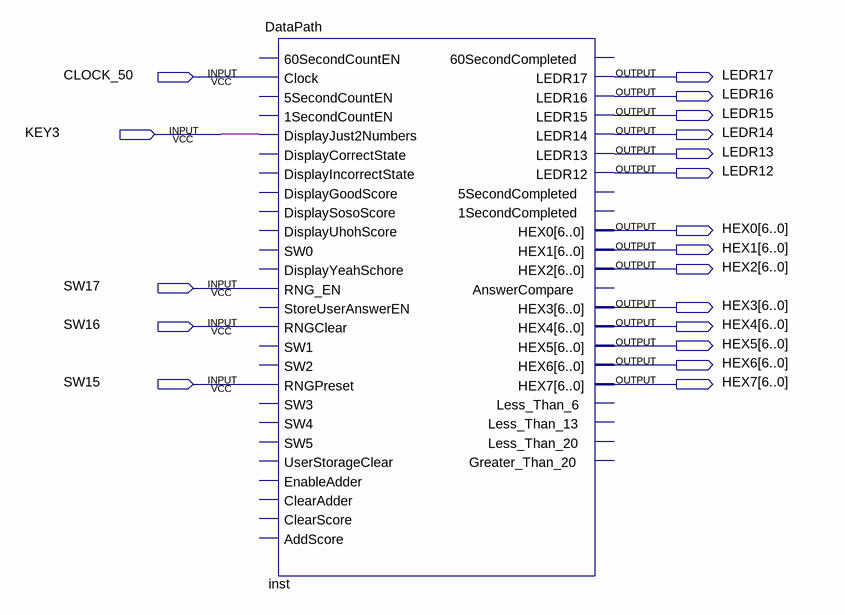
[diagram p0: schematic sheet]
// Quartus schematic Block1.bdf as structural Verilog: 1 symbols, 19 pins
module Block1 (
  input  CLOCK_50,
  input  KEY3,
  input  SW17,
  input  SW16,
  input  SW15,
  output LEDR17,
  output LEDR16,
  output LEDR15,
  output LEDR14,
  output LEDR13,
  output LEDR12,
  output [6:0] HEX0,
  output [6:0] HEX1,
  output [6:0] HEX2,
  output [6:0] HEX3,
  output [6:0] HEX4,
  output [6:0] HEX5,
  output [6:0] HEX6,
  output [6:0] HEX7
);

  DataPath inst (
    .Clock(CLOCK_50), .DisplayJust2Numbers(KEY3), .RNG_EN(SW17), .RNGClear(SW16), .RNGPreset(SW15),
    .LEDR17(LEDR17), .LEDR16(LEDR16), .LEDR15(LEDR15), .LEDR14(LEDR14), .LEDR13(LEDR13), .LEDR12(LEDR12),
    .HEX0(HEX0), .HEX1(HEX1), .HEX2(HEX2), .HEX3(HEX3), .HEX4(HEX4), .HEX5(HEX5), .HEX6(HEX6), .HEX7(HEX7));  // open: 60SecondCountEN, 5SecondCountEN, 1SecondCountEN, DisplayCorrectState, DisplayIncorrectState, DisplayGoodScore, DisplaySosoScore, DisplayUhohScore, SW0, DisplayYeahSchore, StoreUserAnswerEN, SW1, SW2, SW3, SW4, SW5, UserStorageClear, EnableAdder, ClearAdder, ClearScore, AddScore, 60SecondCompleted, 5SecondCompleted, 1SecondCompleted, AnswerCompare, Less_Than_6, Less_Than_13, Less_Than_20, Greater_Than_20
endmodule
